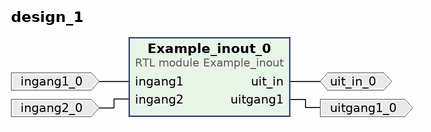
[diagram p0: block diagram of the top level]
# Vivado block design design_1, xc7z007sclg225-1, Vivado 2019.2
create_bd_design design_1

create_bd_port -dir I ingang1_0
create_bd_port -dir I ingang2_0
create_bd_port -dir IO uit_in_0
create_bd_port -dir O uitgang1_0

create_bd_cell -type module -reference Example_inout Example_inout_0

# ---- connections ----

connect_bd_net -net ingang1_0_1 [get_bd_ports ingang1_0] [get_bd_pins Example_inout_0/ingang1]
connect_bd_net -net ingang2_0_1 [get_bd_ports ingang2_0] [get_bd_pins Example_inout_0/ingang2]
connect_bd_net [get_bd_ports uit_in_0] [get_bd_pins Example_inout_0/uit_in]
connect_bd_net [get_bd_pins Example_inout_0/uitgang1] [get_bd_ports uitgang1_0]

validate_bd_design
save_bd_design
